# EAGLE design untitled (EAGLE 9.6.0)
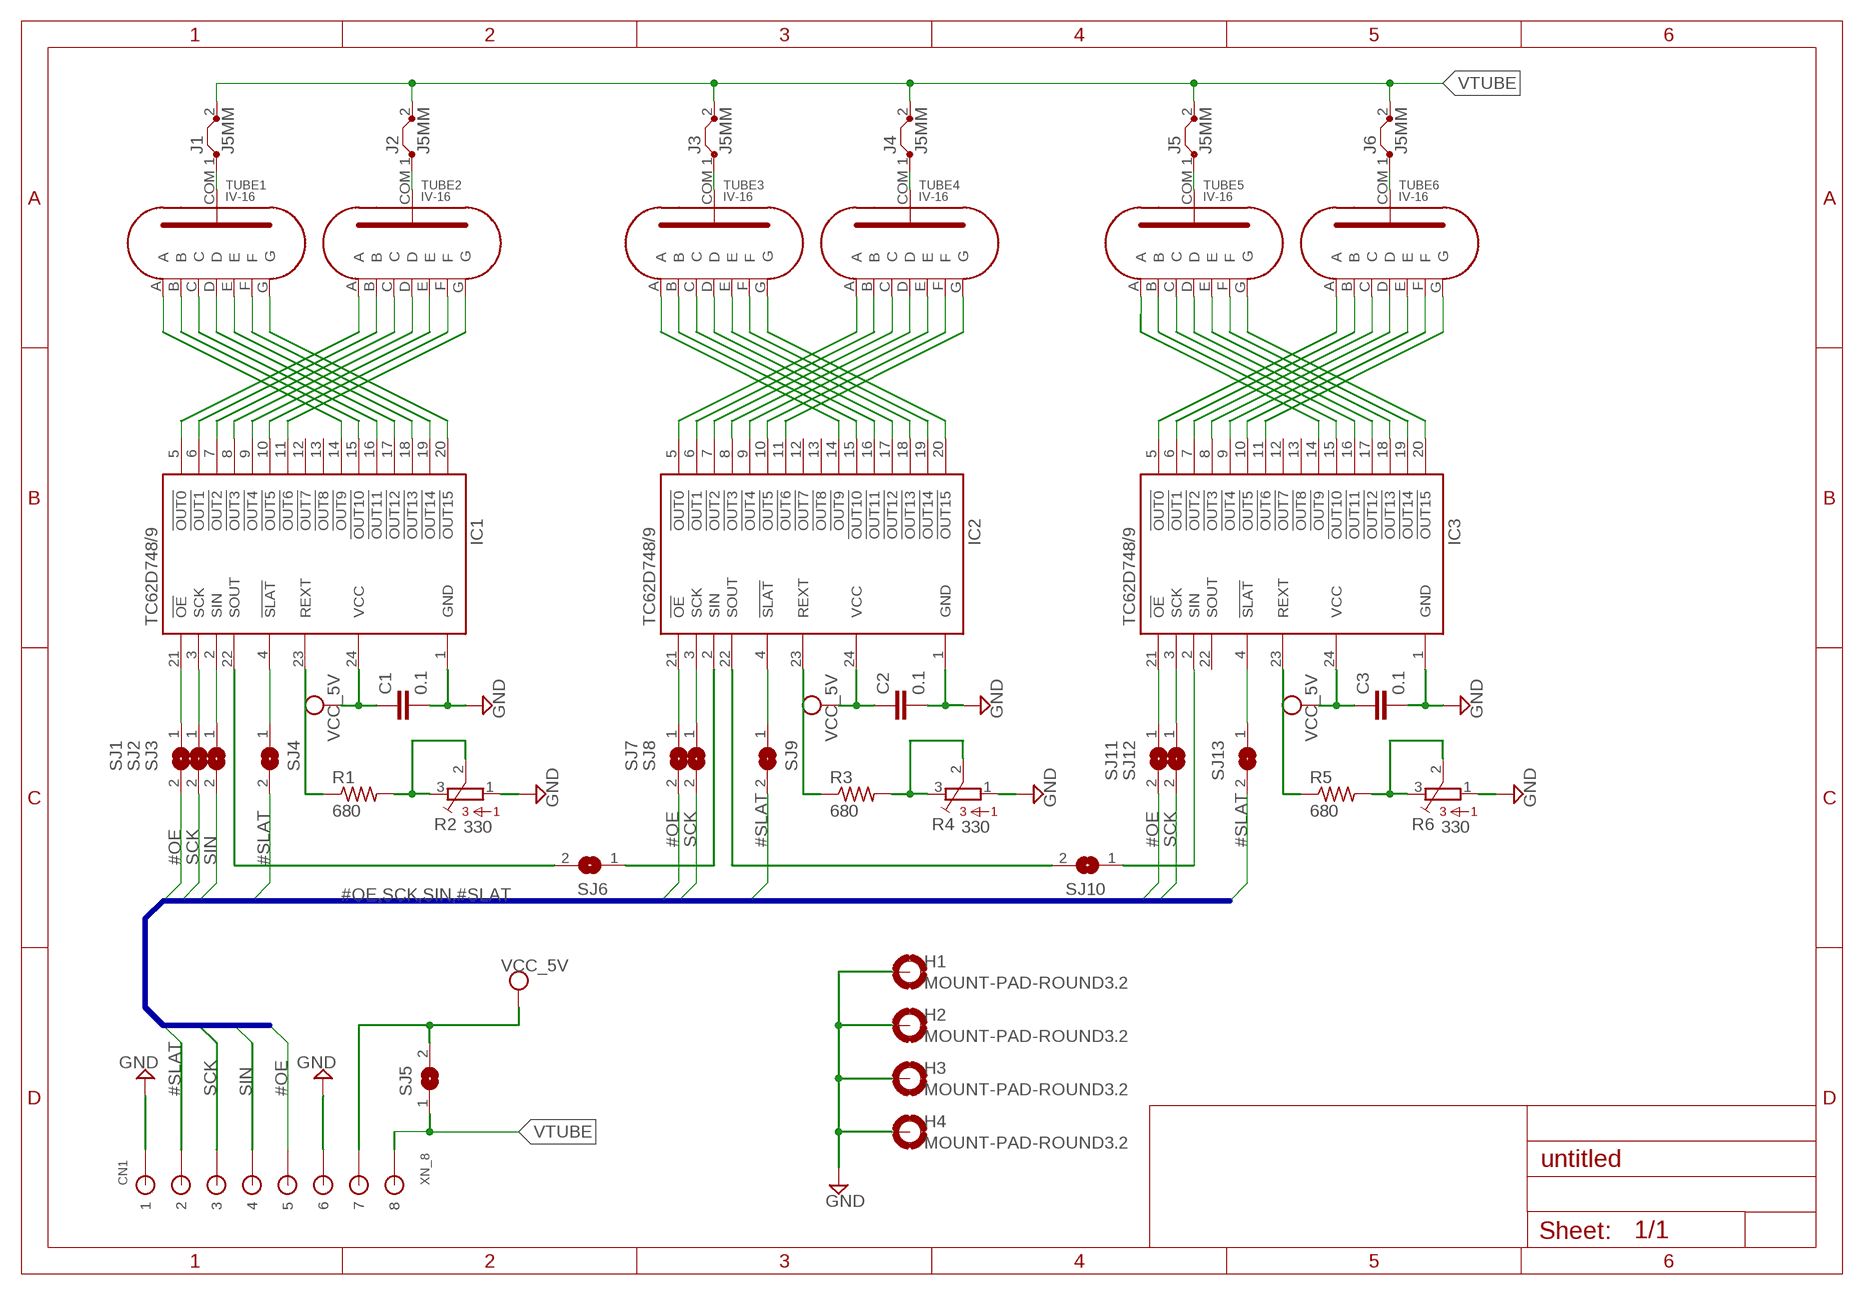
[diagram p0: schematic, sheet 1]

## Parts
C1  0.1  C-EUC2012  [C2012]
C2  0.1  C-EUC2012  [C2012]
C3  0.1  C-EUC2012  [C2012]
CN1  XN_8  CON8  [CON8]
H1  MOUNT-PAD-ROUND3.2  [3,2-PAD]
H2  MOUNT-PAD-ROUND3.2  [3,2-PAD]
H3  MOUNT-PAD-ROUND3.2  [3,2-PAD]
H4  MOUNT-PAD-ROUND3.2  [3,2-PAD]
IC1  TC62D748CFG  [TSSOP-24]
IC2  TC62D748CFG  [TSSOP-24]
IC3  TC62D748CFG  [TSSOP-24]
J1  J5MM  [05]
J2  J5MM  [05]
J3  J5MM  [05]
J4  J5MM  [05]
J5  J5MM  [05]
J6  J5MM  [05]
R1  680  R-US_0309/V  [0309V]
R2  330  3362P  [3362P]
R3  680  R-US_0309/V  [0309V]
R4  330  3362P  [3362P]
R5  680  R-US_0309/V  [0309V]
R6  330  3362P  [3362P]
SJ1  SJ  [SJ]
SJ2  SJ  [SJ]
SJ3  SJ  [SJ]
SJ4  SJ  [SJ]
SJ5  SJ  [SJ]
SJ6  SJ  [SJ]
SJ7  SJ  [SJ]
SJ8  SJ  [SJ]
SJ9  SJ  [SJ]
SJ10  SJ  [SJ]
SJ11  SJ  [SJ]
SJ12  SJ  [SJ]
SJ13  SJ  [SJ]
TUBE1  IV-16  [IV-17_COMP]
TUBE2  IV-16  [IV-17_COMP]
TUBE3  IV-16  [IV-17_COMP]
TUBE4  IV-16  [IV-17_COMP]
TUBE5  IV-16  [IV-17_COMP]
TUBE6  IV-16  [IV-17_COMP]

## Nets
#OE: CN1.P$5 SJ1.2 SJ7.2 SJ11.2
#SLAT: CN1.P$2 SJ4.2 SJ9.2 SJ13.2
GND: C1.2 C2.2 C3.2 CN1.P$1 CN1.P$6 H1.B3,2(MOUNT) H2.B3,2(MOUNT) H3.B3,2(MOUNT) H4.B3,2(MOUNT) IC1.1(GND) IC2.1(GND) IC3.1(GND) R2.1 R4.1 R6.1
N$1: IC1.22(SOUT) SJ6.2
N$3: IC1.14(!OUT9) TUBE1.A
N$4: IC1.11(!OUT6) TUBE2.G
N$5: IC1.16(!OUT11) TUBE1.C
N$6: IC1.17(!OUT12) TUBE1.D
N$7: IC1.18(!OUT13) TUBE1.E
N$8: IC1.19(!OUT14) TUBE1.F
N$9: IC2.6(!OUT1) TUBE4.B
N$10: IC2.7(!OUT2) TUBE4.C
N$11: IC2.9(!OUT4) TUBE4.E
N$12: IC2.8(!OUT3) TUBE4.D
N$13: IC2.10(!OUT5) TUBE4.F
N$14: IC2.11(!OUT6) TUBE4.G
N$15: IC2.14(!OUT9) TUBE3.A
N$16: IC3.6(!OUT1) TUBE6.B
N$17: IC2.15(!OUT10) TUBE3.B
N$18: IC3.7(!OUT2) TUBE6.C
N$19: IC2.17(!OUT12) TUBE3.D
N$20: IC3.8(!OUT3) TUBE6.D
N$21: IC2.19(!OUT14) TUBE3.F
N$22: IC3.10(!OUT5) TUBE6.F
N$23: IC2.5(!OUT0) TUBE4.A
N$24: IC3.11(!OUT6) TUBE6.G
N$25: IC3.9(!OUT4) TUBE6.E
N$26: IC3.14(!OUT9) TUBE5.A
N$28: IC3.16(!OUT11) TUBE5.C
N$29: IC3.18(!OUT13) TUBE5.E
N$30: IC3.5(!OUT0) TUBE6.A
N$31: IC3.15(!OUT10) TUBE5.B
N$33: IC2.2(SIN) SJ6.1
N$35: IC3.19(!OUT14) TUBE5.F
N$44: IC1.23(REXT) R1.1
N$45: IC2.23(REXT) R3.1
N$46: IC3.23(REXT) R5.1
N$47: IC3.17(!OUT12) TUBE5.D
N$48: R1.2 R2.2 R2.3
N$50: IC2.22(SOUT) SJ10.2
N$51: IC3.2(SIN) SJ10.1
N$52: R3.2 R4.2 R4.3
N$53: IC1.21(!OE) SJ1.1
N$54: IC1.3(SCK) SJ2.1
N$55: IC1.2(SIN) SJ3.1
N$56: IC1.4(!SLAT) SJ4.1
N$57: IC2.21(!OE) SJ7.1
N$58: IC2.3(SCK) SJ8.1
N$59: IC2.4(!SLAT) SJ9.1
N$60: IC3.21(!OE) SJ11.1
N$61: IC3.3(SCK) SJ12.1
N$62: IC1.15(!OUT10) TUBE1.B
N$63: IC3.4(!SLAT) SJ13.1
N$64: J1.1 TUBE1.COM
N$65: J2.1 TUBE2.COM
N$66: J3.1 TUBE3.COM
N$67: J4.1 TUBE4.COM
N$68: J5.1 TUBE5.COM
N$69: J6.1 TUBE6.COM
N$70: R5.2 R6.2 R6.3
N$71: IC2.16(!OUT11) TUBE3.C
N$72: IC3.20(!OUT15) TUBE5.G
N$74: IC2.20(!OUT15) TUBE3.G
N$75: IC1.20(!OUT15) TUBE1.G
N$76: IC2.18(!OUT13) TUBE3.E
N$77: IC1.10(!OUT5) TUBE2.F
N$78: IC1.9(!OUT4) TUBE2.E
N$79: IC1.8(!OUT3) TUBE2.D
N$80: IC1.7(!OUT2) TUBE2.C
N$81: IC1.5(!OUT0) TUBE2.A
N$82: IC1.6(!OUT1) TUBE2.B
SCK: CN1.P$3 SJ2.2 SJ8.2 SJ12.2
SIN: CN1.P$4 SJ3.2
VCC_5V: C1.1 C2.1 C3.1 CN1.P$7 IC1.24(VCC) IC2.24(VCC) IC3.24(VCC) SJ5.2
VTUBE: CN1.P$8 J1.2 J2.2 J3.2 J4.2 J5.2 J6.2 SJ5.1
Unconnected: IC1.12(!OUT7) IC1.13(!OUT8) IC2.12(!OUT7) IC2.13(!OUT8) IC3.12(!OUT7) IC3.13(!OUT8) IC3.22(SOUT)

## Buses
#OE,SCK,SIN,#SLAT

## Library data of the parts
C1-C3 = rcl:C-EU: CAPACITOR, European symbol
CN1 = 1-MyLib:CON8: LOW INSERTION CONNECTOR 8
H1-H4 = holes:MOUNT-PAD-ROUND: MOUNTING PAD, round
IC1-IC3 = 11MyLib:TC62D748CFG
J1-J6 = jumper:J: Bridge
R1 R3 R5 = rcl:R-US_: RESISTOR, American symbol; SPICEPREFIX: R
R2 R4 R6 = bourns:3362: 3362 Series 1/4" Square Trimmer
SJ1-SJ13 = jumper:SJ: SMD solder JUMPER
TUBE1-TUBE6 = 11MyLib:IV-16

## Board
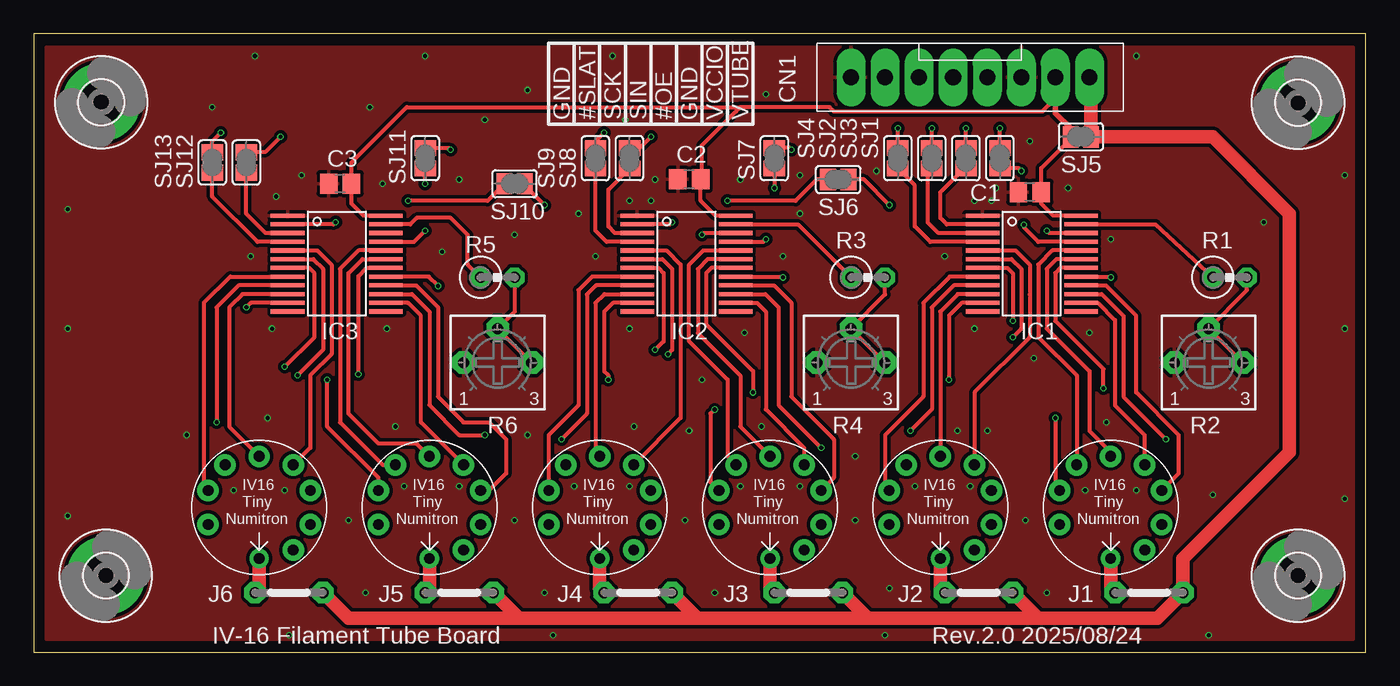
[diagram p1: board, top side]
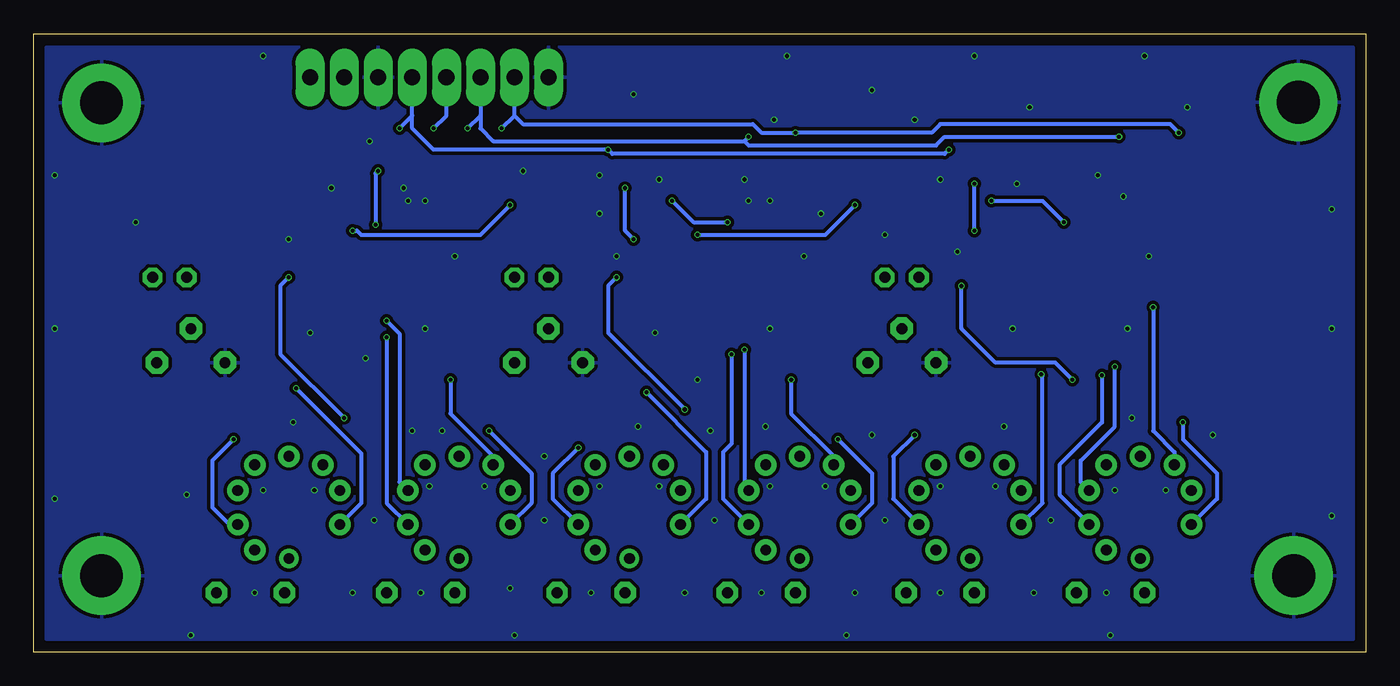
[diagram p2: board, bottom side, seen from below]

Size 99.36 x 46.12 mm. Coordinates in mm from the lower left corner, seen from the top.
Outline: 0,0 99.36,0 99.36,46.12 0,46.12 0,0
Copper layers (1*16): Top 0.035mm / dielectric 1.6mm / Bottom 0.035mm
Design rules "jlcpcb-2layers": minimum track width 5mil, minimum drill 0.3mm, track to track 5mil, track to pad 5mil, pad to pad 5mil, via to via 5mil, smd to smd 5mil, copper to edge 0.2mm, drill to drill 6mil, minimum pad ring 10mil, minimum via ring 3mil, stop-mask expansion 4mil, vias tented up to drill 0mil, thermal gap 10mil

### Footprints (pad centres in the part's own frame; a part is rotated, then mirrored left to right if it is on the bottom)
C2012 = smd 1.3 x 1.5: 1 -0.85,0; 2 0.85,0
CON8 = drill 1.2 long: P$1 8.89,0; P$2 6.35,0; P$3 3.81,0; P$4 1.27,0; P$5 -1.27,0; P$6 -3.81,0; P$7 -6.35,0; P$8 -8.89,0
3,2-PAD = drill 3.2 pad 5.842: B3,2 0,0
TSSOP-24 = smd 0.305 x 2.5: 1 -3.575,-3.668; 2 -2.925,-3.668; 3 -2.275,-3.668; 4 -1.625,-3.668; 5 -0.975,-3.668; 6 -0.325,-3.668; 7 0.325,-3.668; 8 0.975,-3.668; 9 1.625,-3.668; 10 2.275,-3.668; 11 2.925,-3.668; 12 3.575,-3.668; 13 3.575,3.668; 14 2.925,3.668; 15 2.275,3.668; 16 1.625,3.668; 17 0.975,3.668; 18 0.325,3.668; 19 -0.325,3.668; 20 -0.975,3.668; 21 -1.625,3.668; 22 -2.275,3.668; 23 -2.925,3.668; 24 -3.575,3.668
05 = drill 0.813 pad 1.6 octagon: 1 -2.54,0; 2 2.54,0
0309V = drill 0.813 octagon: 1 -1.27,0; 2 1.27,0
3362P = drill 0.813 pad 1.676 octagon: 1 -2.54,0; 2 0,2.54; 3 2.54,0
SJ = smd 1.168 x 1.6: 1 -0.762,0; 2 0.762,0
IV-17_COMP = drill 0.8 pad 1.6: A 2.54,3.175; B 3.81,-1.27; C 3.81,1.27; D -3.81,1.27; E -3.81,-1.27; F 0,3.81; G -2.54,3.175; NC 2.54,-3.175 | drill 0.8: COM 0,-3.81

### Placement (x,y rotation side)
C1  74.3,34.3 180 top
C2  48.9,35.25 180 top
C3  22.86,34.94 180 top
CN1  69.85,42.86 180 top
H1  5.4,5.71 0 top
H2  94.3,40.96 0 top
H3  5.05,41.01 0 top
H4  94.3,5.71 0 top
IC1  74.44,28.98 270 top
IC2  48.69,28.98 270 top
IC3  22.62,28.98 270 top
J1  83.19,4.45 0 top
J2  70.48,4.45 0 top
J3  57.78,4.45 0 top
J4  45.09,4.45 0 top
J5  31.75,4.45 0 top
J6  19.05,4.45 0 top
R1  89.22,27.94 0 top
R2  87.63,21.59 0 top
R3  62.23,27.94 0 top
R4  60.96,21.59 0 top
R5  34.61,27.94 0 top
R6  34.61,21.59 0 top
SJ1  72.07,36.83 90 top
SJ2  66.99,36.83 90 top
SJ3  69.53,36.83 90 top
SJ4  64.45,36.83 90 top
SJ5  78.11,38.42 180 top
SJ6  60.01,35.24 0 top
SJ7  55.24,36.83 90 top
SJ8  44.45,36.83 90 top
SJ9  41.91,36.83 90 top
SJ10  35.88,34.92 0 top
SJ11  29.21,36.83 90 top
SJ12  15.88,36.51 90 top
SJ13  13.34,36.51 90 top
TUBE1  80.33,10.79 0 top
TUBE2  67.63,10.79 0 top
TUBE3  54.93,10.79 0 top
TUBE4  42.23,10.79 0 top
TUBE5  29.53,10.79 0 top
TUBE6  16.83,10.79 0 top

### Tracks (layer width: path | path; a pad name or v marks a point on that pad's centre or on a via)
#OE  (via drill 0.3)
  Top 0.305: SJ1.2 v72.07,39.05 | v56.52,37.47 56.39,37.59 SJ7.2 | SJ11.2 30.99,37.59 v31.11,37.47
  Bottom 0.305: v72.07,39.05 71.12,40.01 | 71.12,40.01 CN1.P$5 | v31.11,37.47 31.43,37.15 56.2,37.15 v56.52,37.47 69.53,37.47 71.12,39.05 71.12,40.01
#SLAT  (via drill 0.3)
  Top 0.305: SJ4.2 v64.45,39.05 | SJ9.2 41.91,38.1 v42.55,38.73 | SJ13.2 13.34,38.1 v13.97,38.73
  Bottom 0.305: v64.45,39.05 63.5,40.01 | 63.5,40.01 63.5,40.96 CN1.P$2 | 63.5,40.01 62.87,39.37 45.72,39.37 45.09,38.73 v42.55,38.73 32.38,38.73 31.75,39.37 14.61,39.37 v13.97,38.73
GND  (via drill 0.3)
  other vias: 2.54,33.02 2.54,24.13 2.54,10.16 16.51,44.45 43.18,44.45 29.21,44.45 19.05,1.27 38.73,1.27 63.5,1.27 87.63,1.27 97.79,11.43 97.79,35.56 97.79,24.13 18.1,33.97 20,35.56 44.45,33.66 46.04,33.66 46.35,35.24 70.17,33.66 71.44,33.66 71.75,34.61 74.3,38.1 31.75,35.24 35.88,31.11 30.48,29.84 55.88,29.53 41.91,29.53 44.45,24.13 67.94,29.53 80.33,30.8 77.15,34.61 91.76,32.07 87.95,11.75 82.23,12.06 78.42,12.06 80.01,17.14 74.61,21.91 70.17,24.13 82.87,4.45 75.56,4.45 70.48,4.45 63.82,4.76 57.78,4.45 50.8,4.45 45.09,4.45 38.1,4.45 31.75,4.45 24.77,4.45 19.37,4.45 14.92,12.06 18.73,12.06 27.62,12.38 31.75,12.38 40.32,12.38 44.45,12.38 52.7,12.38 57.15,12.38 65.72,12.38 69.85,12.38 61.28,14.61 57.15,32.7 57.15,35.56 62.87,35.88 40.64,32.7 26.04,34.92 17.78,24.13 26.35,24.13 26.99,16.83 17.46,17.46 36.83,16.19 44.77,16.83 48.9,16.51 49.85,20.32 53.02,23.81 78.74,23.81 68.9,16.51 73.98,9.84 71.12,16.51 23.5,9.84 35.88,9.84 48.58,9.84 61.28,9.84 11.43,16.19 16.19,29.53 13.34,40.64 25.08,40.64 36.83,41.91 52.7,35.24 54.29,16.83 33.66,39.69 44.13,39.69 54.61,41.59 82.23,44.45
  pour Top (isolate 0.254): 0.95,45.09 98.42,45.09 98.42,0.95 0.95,0.95
  pour Bottom (isolate 0.254): 98.42,45.09 0.95,45.09 0.95,0.95 98.42,0.95
N$1  (via drill 0.3)
  Top 0.305: IC1.22 75.75,31.25 v75.56,31.43 | v63.82,33.34 61.91,35.24 SJ6.2
  Bottom 0.305: v75.56,31.43 75.25,31.43 74.93,31.11 66.04,31.11 v63.82,33.34
N$3
  Top 0.305: IC1.14 79.36,26.05 80.64,24.77 80.64,18.41 82.87,16.19 TUBE1.A
N$4  (via drill 0.3)
  Top 0.305: IC1.11 69.23,26.05 68.28,25.09 v68.28,20.32
  Bottom 0.305: v68.28,20.32 68.28,17.78 65.09,14.59 TUBE2.G
N$5
  Top 0.305: IC1.16 79.97,27.35 82.23,25.08 82.23,19.37 85.41,16.19 85.41,13.34 TUBE1.C
N$6  (via drill 0.3)
  Top 0.305: IC1.17 80.27,28 v80.33,27.94 | v76.2,17.46 76.2,12.38 TUBE1.D
  Bottom 0.305: v80.33,27.94 80.96,27.3 80.96,22.23 v76.2,17.46
N$7  (via drill 0.3)
  Top 0.305: IC1.18 76.59,28.65 76.2,28.26 76.2,24.7 79.78,21.12 v79.78,19.68
  Bottom 0.305: v79.78,19.68 74.93,14.83 74.93,11.11 TUBE1.E
N$8
  Top 0.305: IC1.19 76.29,29.3 75.56,28.57 75.56,24.13 78.74,20.95 78.74,16.51 80.33,14.92 TUBE1.F
N$9  (via drill 0.3)
  Top 0.305: IC2.6 46.9,29.3 47.62,28.57 47.62,22.54 v47.31,22.23
  Bottom 0.305: v47.31,22.23 47.31,15.56 47.94,14.92 47.94,11.43 TUBE4.B
N$10  (via drill 0.3)
  Top 0.305: IC2.7 46.6,28.65 46.99,28.26 46.99,23.18 v46.35,22.54
  Bottom 0.305: v46.35,22.54 46.35,12.38 TUBE4.C
N$11  (via drill 0.3)
  Top 0.305: IC2.9 41.95,27.35 41.27,26.67 41.27,17.78 v39.37,15.88
  Bottom 0.305: v39.37,15.88 36.83,13.34 36.83,11.11 TUBE4.E
N$12
  Top 0.305: IC2.8 41.65,28 40.64,26.99 40.64,18.41 38.42,16.19 TUBE4.D
N$13
  Top 0.305: TUBE4.F 41.91,14.92 41.91,26.04 42.58,26.7 IC2.10
N$14  (via drill 0.3)
  Top 0.305: IC2.11 43.21,26.05 42.55,25.39 42.55,20.95 42.86,20.64 v42.86,20.32
  Bottom 0.305: v42.86,20.32 42.86,17.78 39.69,14.61 TUBE4.G
N$15
  Top 0.305: IC2.14 53.96,26.05 54.61,25.4 54.61,18.1 57.47,15.24 TUBE3.A
N$16  (via drill 0.3)
  Top 0.305: IC3.6 20.86,29.3 21.59,28.57 21.59,22.54 v19.68,20.64
  Bottom 0.305: TUBE6.B 22.86,11.75 22.86,13.97 19.68,17.14 v19.68,20.64
N$17  (via drill 0.3)
  Top 0.305: IC2.15 54.58,26.7 55.56,25.72 55.56,18.41 v58.74,15.24
  Bottom 0.305: v58.74,15.24 60.64,13.34 60.64,11.43 TUBE3.B
N$18  (via drill 0.3)
  Top 0.305: v18.73,21.27 20.95,23.49 20.95,28.25 20.55,28.65 IC3.7
  Bottom 0.305: TUBE6.C 21.27,12.7 21.27,14.29 18.73,16.83 v18.73,21.27
N$19  (via drill 0.3)
  Top 0.305: IC2.17 55.82,28 v55.88,27.94 | v50.8,18.1 50.48,17.78 50.48,12.7 TUBE3.D
  Bottom 0.305: v55.88,27.94 56.52,27.3 56.52,23.81 v50.8,18.1
N$20
  Top 0.305: TUBE6.D 12.7,12.38 12.7,26.04 14.66,28 IC3.8
N$21
  Top 0.305: IC2.19 50.27,29.3 49.54,28.57 49.54,23.8 52.7,20.63 52.7,16.83 TUBE3.F
N$22
  Top 0.305: IC3.10 15.59,26.7 14.61,25.72 14.61,16.83 TUBE6.F
N$23
  Top 0.305: IC2.5 47.2,29.95 48.26,28.89 48.26,17.46 TUBE4.A
N$24  (via drill 0.3)
  Top 0.305: IC3.11 16.21,26.05 v15.88,25.72
  Bottom 0.305: v15.88,25.72 15.88,16.51 14.29,14.92 TUBE6.G
N$25  (via drill 0.3)
  Top 0.305: IC3.9 15.29,27.35 13.65,25.72 v13.65,17.14
  Bottom 0.305: v13.65,17.14 13.65,15.88 11.11,13.34 11.11,11.43 TUBE6.E
N$26
  Top 0.305: TUBE5.A 28.89,17.14 28.89,25.08 27.93,26.05 IC3.14
N$28
  Top 0.305: TUBE5.C 33.97,12.06 35.24,13.34 35.24,15.88 33.97,17.14 32.07,17.14 30.16,19.05 30.16,25.72 28.53,27.35 IC3.16
N$29  (via drill 0.3)
  Top 0.305: v24.23,20.73 24.23,28.04 24.84,28.65 IC3.18
  Bottom 0.305: TUBE5.E 24.13,11.11 24.13,20.64 v24.23,20.73
N$30
  Top 0.305: IC3.5 21.17,29.95 22.23,28.89 22.23,22.23 20.64,20.64 20.64,15.24 TUBE6.A
N$31  (via drill 0.3)
  Top 0.305: IC3.15 28.23,26.7 29.53,25.4 29.53,18.41 31.75,16.19 v33.66,16.19
  Bottom 0.305: v33.66,16.19 35.24,14.61 35.24,11.43 TUBE5.B
N$33  (via drill 0.3)
  Top 0.305: SJ6.1 58.61,35.24 58.42,35.24 56.83,33.66 v51.75,33.66 | v47.62,32.07 47.46,31.9 IC2.2
  Bottom 0.305: v51.75,33.66 50.16,32.07 v47.62,32.07
N$35
  Top 0.305: TUBE5.F 28.57,15.56 25.72,15.56 23.5,17.78 23.5,28.26 24.54,29.3 IC3.19
N$44
  Top 0.305: R1.1 83.67,31.9 IC1.23
N$45
  Top 0.305: IC2.23 57,31.9 R3.1
N$46
  Top 0.305: R5.1 32.38,28.89 32.38,31.11 31.11,32.38 28.57,32.38 28.09,31.9 IC3.23
N$47  (via drill 0.3)
  Top 0.305: TUBE5.D 25.72,13.02 21.91,16.83 v21.91,20.32 | v30.16,27.3 29.47,28 IC3.17
  Bottom 0.305: v21.91,20.32 23.18,21.59 27.62,21.59 30.16,24.13 v30.16,27.3
N$48
  Top 0.305: R2.3 R2.2 90.49,26.99 R1.2
N$50  (via drill 0.3)
  Top 0.305: IC2.22 49.98,31.25 v49.85,31.11 | v38.1,33.34 36.84,34.59 36.84,34.69 36.64,34.89 SJ10.2
  Bottom 0.305: v49.85,31.11 40.32,31.11 v38.1,33.34
N$51  (via drill 0.3)
  Top 0.305: SJ10.1 33.85,33.66 v27.94,33.66 | v22.54,32.07 22.38,31.9 IC3.2
  Bottom 0.305: v27.94,33.66 24.13,33.66 v22.54,32.07
N$52
  Top 0.305: R4.3 R4.2 63.5,26.67 R3.2
N$53  (via drill 0.3)
  Top 0.305: v73.86,31.87 73.86,31.67 74.93,30.6 IC1.21 | SJ1.1 73.47,36.07 v73.66,35.88
  Bottom 0.305: v73.66,35.88 73.86,35.68 v73.86,31.87
N$54
  Top 0.305: IC1.3 67.49,31.25 66.67,32.07 66.67,35.75 SJ2.1
N$55
  Top 0.305: IC1.2 68.11,31.9 67.63,32.38 67.63,34.29 69.41,36.07 SJ3.1
N$56
  Top 0.305: IC1.4 66.87,30.6 65.72,31.75 65.72,34.8 SJ4.1
N$57  (via drill 0.3)
  Top 0.305: IC2.21 54.41,30.6 v54.61,30.8 | SJ7.1 v55.24,34.61
  Bottom 0.305: v54.61,30.8 55.24,31.43 v55.24,34.61
N$58
  Top 0.305: IC2.3 43.36,31.25 42.86,31.75 42.86,34.48 SJ8.1
N$59
  Top 0.305: IC2.4 42.74,30.6 41.91,31.43 SJ9.1
N$60  (via drill 0.3)
  Top 0.305: IC3.21 28.38,30.6 v29.21,31.43 | v29.21,34.92 SJ11.1
  Bottom 0.305: v29.21,31.43 v29.21,34.92
N$61
  Top 0.305: IC3.3 17.33,31.25 15.88,32.7 SJ12.1
N$62  (via drill 0.3)
  Top 0.305: IC1.15 79.66,26.7 81.28,25.08 81.28,19.05 v84.45,15.88
  Bottom 0.305: v84.45,15.88 86.04,14.29 86.04,10.79 84.77,9.53 TUBE1.B
N$63
  Top 0.305: IC3.4 16.71,30.6 13.34,33.97 SJ13.1
N$64
  Top 1.016: TUBE1.COM 80.33,4.76 J1.1
N$65
  Top 1.016: TUBE2.COM 67.63,4.76 J2.1
N$66
  Top 1.016: TUBE3.COM 54.93,4.76 J3.1
N$67
  Top 1.016: TUBE4.COM 42.23,4.76 J4.1
N$68
  Top 1.016: TUBE5.COM 29.53,4.76 J5.1
N$69
  Top 1.016: TUBE6.COM 16.83,4.76 J6.1
N$70
  Top 0.305: R5.2 35.88,25.4 R6.2 R6.3
N$71
  Top 0.305: IC2.16 55.2,27.35 56.52,26.04 56.52,19.05 59.69,15.88 59.69,13.02 TUBE3.C
N$72
  Top 0.305: IC3.20 24.23,29.95 22.86,28.57 22.86,17.14 26.04,13.97 TUBE5.G
N$74
  Top 0.305: TUBE3.G 51.75,14.61 51.75,20.32 48.9,23.18 48.9,28.89 49.95,29.95 IC2.20
N$75
  Top 0.305: IC1.20 75.99,29.95 74.93,28.89 74.93,23.5 77.79,20.64 TUBE1.G
N$76  (via drill 0.3)
  Top 0.305: IC2.18 50.56,28.65 50.16,28.26 50.16,24.45 53.66,20.95 v53.66,19.37
  Bottom 0.305: v53.66,19.37 49.21,14.92 49.21,11.43 TUBE3.E
N$77
  Top 0.305: IC1.10 68.93,26.7 67.63,25.4 TUBE2.F
N$78  (via drill 0.3)
  Top 0.305: IC1.9 68.62,27.35 66.99,25.72 66.99,18.1 v65.41,16.51
  Bottom 0.305: v65.41,16.51 62.23,13.34 62.23,11.11 TUBE2.E
N$79
  Top 0.305: IC1.8 68.32,28 66.36,26.04 66.36,19.05 63.5,16.19 63.5,12.38 TUBE2.D
N$80  (via drill 0.3)
  Top 0.305: IC1.7 72.63,28.65 73.03,28.26 v73.03,24.7
  Bottom 0.305: v73.03,24.7 72.07,23.75 72.07,12.7 TUBE2.C
N$81
  Top 0.305: IC1.5 73.24,29.95 74.3,28.89 74.3,26.67 74.3,23.5 70.17,19.37 TUBE2.A
N$82  (via drill 0.3)
  Top 0.305: IC1.6 72.94,29.3 73.66,28.57 73.66,24.13 v73.03,23.5
  Bottom 0.305: v73.03,23.5 73.03,11.11 TUBE2.B
SCK  (via drill 0.3)
  Top 0.305: SJ2.2 v66.99,39.05 | SJ8.2 45.21,37.59 v46.04,38.42 | v18.41,38.42 17.27,37.27 SJ12.2
  Bottom 0.305: v66.99,39.05 66.04,40.01 | CN1.P$3 66.04,40.01 | 46.35,38.1 65.09,38.1 66.04,39.05 66.04,40.01 | 46.35,38.1 46.04,37.78 32.07,37.78 31.43,38.42 v18.41,38.42 | v46.04,38.42 46.35,38.1
SIN  (via drill 0.3)
  Top 0.305: SJ3.2 v69.53,39.05
  Bottom 0.305: v69.53,39.05 68.58,40.01 CN1.P$4
VCC_5V
  Top 0.305: IC1.24 76.03,32.55 75.14,33.44 C1.1 75.14,36.09 77.34,38.29 | IC2.24 50.86,32.55 49.74,33.66 C2.1 49.85,35.35 49.85,37.78 52.39,40.32 52.7,40.64 | 52.7,40.64 59.37,40.64 59.69,40.32 75.25,40.32 76.2,41.27 | IC3.24 24.6,32.55 23.71,33.44 C3.1 23.71,36.52 27.83,40.64 52.7,40.64
  Top 0.406: 77.34,38.29 SJ5.2 77.34,39.05 76.2,40.2 76.2,41.27 CN1.P$7
VTUBE
  Top 1.016: CN1.P$8 78.87,42.74 SJ5.1 87.95,38.42 93.66,32.7 93.66,14.92 85.72,6.99 J1.2 83.82,2.54 74.93,2.54 | 74.93,2.54 62.23,2.54 | 62.23,2.54 49.53,2.54 | 49.53,2.54 36.2,2.54 | 36.2,2.54 23.5,2.54 J6.2 | J5.2 36.2,2.54 | J4.2 49.53,2.54 | J3.2 62.23,2.54 | J2.2 74.93,2.54

### Text on the board
tPlace: GND / #SLAT / SCK / SIN / #OE / GND / VCCIO / VTUBE | IV-16 Filament Tube Board | Rev.2.0 2025/08/24